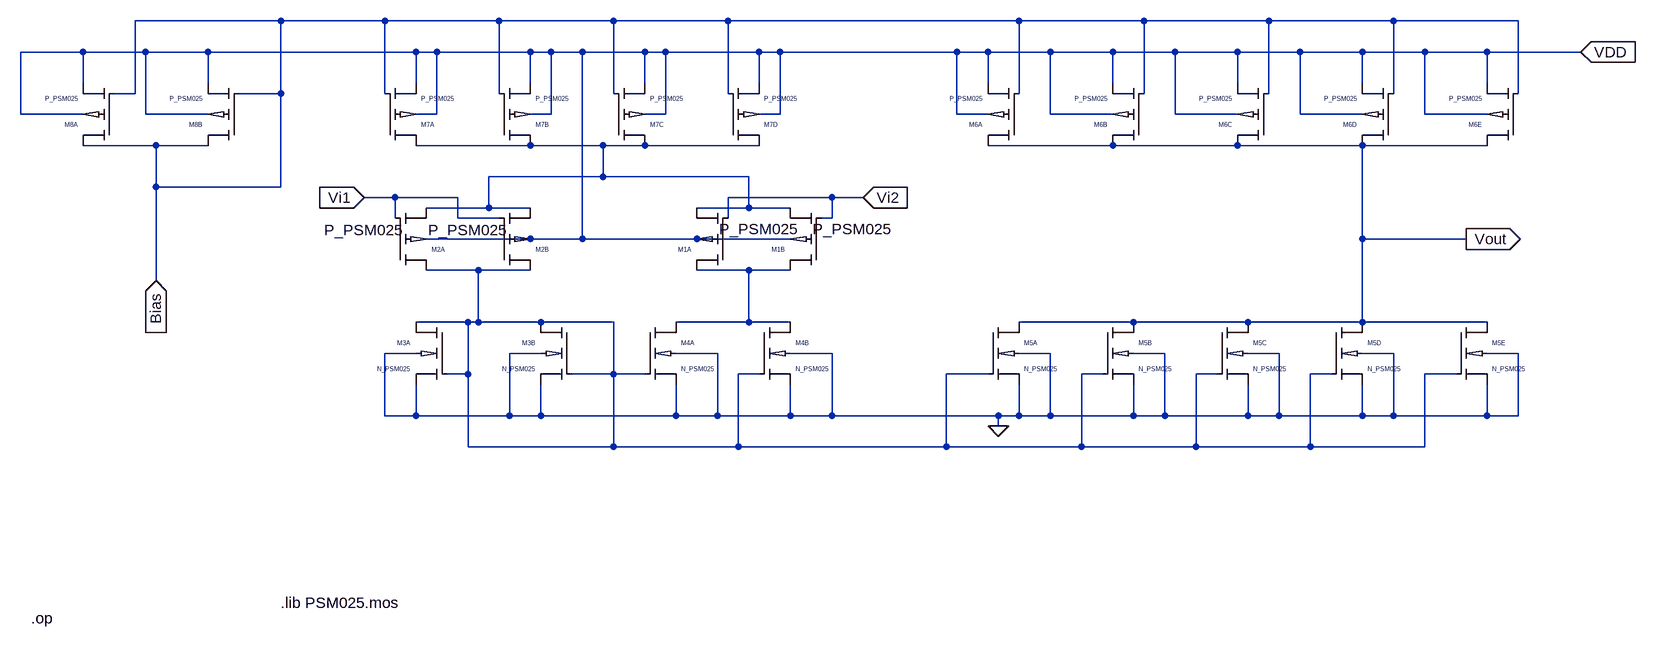
[diagram p0: schematic Draft1.asc]
Draft1.asc, the LTspice schematic file:
Version 4
SHEET 1 1956 744
WIRE -176 -224 -400 -224
WIRE -16 -224 -176 -224
WIRE 160 -224 -16 -224
WIRE 336 -224 160 -224
WIRE 512 -224 336 -224
WIRE 960 -224 512 -224
WIRE 1152 -224 960 -224
WIRE 1344 -224 1152 -224
WIRE 1536 -224 1344 -224
WIRE 1728 -224 1536 -224
WIRE -480 -176 -576 -176
WIRE -384 -176 -480 -176
WIRE -288 -176 -384 -176
WIRE 32 -176 -288 -176
WIRE 64 -176 32 -176
WIRE 208 -176 64 -176
WIRE 240 -176 208 -176
WIRE 288 -176 240 -176
WIRE 384 -176 288 -176
WIRE 416 -176 384 -176
WIRE 560 -176 416 -176
WIRE 592 -176 560 -176
WIRE 864 -176 592 -176
WIRE 912 -176 864 -176
WIRE 1008 -176 912 -176
WIRE 1104 -176 1008 -176
WIRE 1200 -176 1104 -176
WIRE 1296 -176 1200 -176
WIRE 1392 -176 1296 -176
WIRE 1488 -176 1392 -176
WIRE 1584 -176 1488 -176
WIRE 1680 -176 1584 -176
WIRE 1824 -176 1680 -176
WIRE -480 -128 -480 -176
WIRE -288 -128 -288 -176
WIRE 32 -128 32 -176
WIRE 208 -128 208 -176
WIRE 384 -128 384 -176
WIRE 560 -128 560 -176
WIRE 912 -128 912 -176
WIRE 1104 -128 1104 -176
WIRE 1296 -128 1296 -176
WIRE 1488 -128 1488 -176
WIRE 1680 -128 1680 -176
WIRE -400 -112 -400 -224
WIRE -400 -112 -432 -112
WIRE -176 -112 -176 -224
WIRE -176 -112 -240 -112
WIRE -16 -112 -16 -224
WIRE 160 -112 160 -224
WIRE 336 -112 336 -224
WIRE 512 -112 512 -224
WIRE 960 -112 960 -224
WIRE 1152 -112 1152 -224
WIRE 1344 -112 1344 -224
WIRE 1536 -112 1536 -224
WIRE 1728 -112 1728 -224
WIRE -576 -80 -576 -176
WIRE -480 -80 -576 -80
WIRE -384 -80 -384 -176
WIRE -288 -80 -384 -80
WIRE 64 -80 64 -176
WIRE 64 -80 32 -80
WIRE 240 -80 240 -176
WIRE 240 -80 208 -80
WIRE 416 -80 416 -176
WIRE 416 -80 384 -80
WIRE 592 -80 592 -176
WIRE 592 -80 560 -80
WIRE 864 -80 864 -176
WIRE 912 -80 864 -80
WIRE 1008 -80 1008 -176
WIRE 1104 -80 1008 -80
WIRE 1200 -80 1200 -176
WIRE 1296 -80 1200 -80
WIRE 1392 -80 1392 -176
WIRE 1488 -80 1392 -80
WIRE 1584 -80 1584 -176
WIRE 1680 -80 1584 -80
WIRE -368 -32 -480 -32
WIRE -288 -32 -368 -32
WIRE 208 -32 32 -32
WIRE 320 -32 208 -32
WIRE 384 -32 320 -32
WIRE 560 -32 384 -32
WIRE 1104 -32 912 -32
WIRE 1296 -32 1104 -32
WIRE 1488 -32 1296 -32
WIRE 1680 -32 1488 -32
WIRE 320 16 320 -32
WIRE 320 16 144 16
WIRE 544 16 320 16
WIRE -368 32 -368 -32
WIRE -176 32 -176 -112
WIRE -176 32 -368 32
WIRE 0 48 -48 48
WIRE 96 48 0 48
WIRE 672 48 512 48
WIRE 720 48 672 48
WIRE 144 64 144 16
WIRE 144 64 48 64
WIRE 208 64 144 64
WIRE 544 64 544 16
WIRE 544 64 464 64
WIRE 608 64 544 64
WIRE 0 80 0 48
WIRE 96 80 96 48
WIRE 160 80 96 80
WIRE 512 80 512 48
WIRE 672 80 672 48
WIRE 672 80 656 80
WIRE 208 112 48 112
WIRE 288 112 288 -176
WIRE 288 112 208 112
WIRE 464 112 288 112
WIRE 608 112 464 112
WIRE 1488 112 1488 -32
WIRE 1648 112 1488 112
WIRE 128 160 48 160
WIRE 208 160 128 160
WIRE 544 160 464 160
WIRE 608 160 544 160
WIRE -368 176 -368 32
WIRE 112 240 32 240
WIRE 128 240 128 160
WIRE 128 240 112 240
WIRE 224 240 128 240
WIRE 336 240 224 240
WIRE 544 240 544 160
WIRE 544 240 432 240
WIRE 608 240 544 240
WIRE 1136 240 960 240
WIRE 1312 240 1136 240
WIRE 1488 240 1488 112
WIRE 1488 240 1312 240
WIRE 1680 240 1488 240
WIRE 32 288 -16 288
WIRE 224 288 176 288
WIRE 496 288 432 288
WIRE 672 288 608 288
WIRE 1008 288 960 288
WIRE 1184 288 1136 288
WIRE 1360 288 1312 288
WIRE 1536 288 1488 288
WIRE 1728 288 1680 288
WIRE 112 320 112 240
WIRE 112 320 80 320
WIRE 336 320 336 240
WIRE 336 320 272 320
WIRE 384 320 336 320
WIRE 560 320 528 320
WIRE 912 320 848 320
WIRE 1088 320 1056 320
WIRE 1264 320 1232 320
WIRE 1440 320 1408 320
WIRE 1632 320 1584 320
WIRE -16 384 -16 288
WIRE 32 384 32 336
WIRE 32 384 -16 384
WIRE 176 384 176 288
WIRE 176 384 32 384
WIRE 224 384 224 336
WIRE 224 384 176 384
WIRE 432 384 432 336
WIRE 432 384 224 384
WIRE 496 384 496 288
WIRE 496 384 432 384
WIRE 608 384 608 336
WIRE 608 384 496 384
WIRE 672 384 672 288
WIRE 672 384 608 384
WIRE 928 384 672 384
WIRE 960 384 960 336
WIRE 960 384 928 384
WIRE 1008 384 1008 288
WIRE 1008 384 960 384
WIRE 1136 384 1136 336
WIRE 1136 384 1008 384
WIRE 1184 384 1184 288
WIRE 1184 384 1136 384
WIRE 1312 384 1312 336
WIRE 1312 384 1184 384
WIRE 1360 384 1360 288
WIRE 1360 384 1312 384
WIRE 1488 384 1488 336
WIRE 1488 384 1360 384
WIRE 1536 384 1536 288
WIRE 1536 384 1488 384
WIRE 1680 384 1680 336
WIRE 1680 384 1536 384
WIRE 1728 384 1728 288
WIRE 1728 384 1680 384
WIRE 928 400 928 384
WIRE 112 432 112 320
WIRE 336 432 336 320
WIRE 336 432 112 432
WIRE 528 432 528 320
WIRE 528 432 336 432
WIRE 848 432 848 320
WIRE 848 432 528 432
WIRE 1056 432 1056 320
WIRE 1056 432 848 432
WIRE 1232 432 1232 320
WIRE 1232 432 1056 432
WIRE 1408 432 1408 320
WIRE 1408 432 1232 432
WIRE 1584 432 1584 320
WIRE 1584 432 1408 432
FLAG 928 400 0
FLAG -48 48 Vi1
IOPIN -48 48 In
FLAG 720 48 Vi2
IOPIN 720 48 In
FLAG 1648 112 Vout
IOPIN 1648 112 Out
FLAG -368 176 Bias
IOPIN -368 176 In
FLAG 1824 -176 VDD
IOPIN 1824 -176 In
SYMBOL P_PSM025 -432 -32 R180
SYMATTR InstName M8A
SYMATTR Value2 l=1u w=8.5u
SYMBOL P_PSM025 656 160 R180
WINDOW 3 -108 63 Left 2
SYMATTR InstName M1B
SYMATTR Value2 l=1u w=8.5u
SYMBOL P_PSM025 0 160 M180
WINDOW 3 -109 62 Left 2
SYMATTR InstName M2A
SYMATTR Value2 l=1u w=8.5u
SYMBOL N_PSM025 80 240 M0
SYMATTR InstName M3A
SYMATTR Value2 l=1u w=2.6u
SYMBOL N_PSM025 384 240 R0
SYMATTR InstName M4A
SYMATTR Value2 l=1u w=2.6u
SYMBOL P_PSM025 -16 -32 M180
SYMATTR InstName M7A
SYMATTR Value2 l=1u w=8.5u
SYMBOL P_PSM025 160 -32 M180
SYMATTR InstName M7B
SYMATTR Value2 l=1u w=8.5u
SYMBOL P_PSM025 -240 -32 R180
SYMATTR InstName M8B
SYMATTR Value2 l=1u w=8.5u
SYMBOL P_PSM025 336 -32 M180
SYMATTR InstName M7C
SYMATTR Value2 l=1u w=8.5u
SYMBOL P_PSM025 512 -32 M180
SYMATTR InstName M7D
SYMATTR Value2 l=1u w=8.5u
SYMBOL P_PSM025 960 -32 R180
SYMATTR InstName M6A
SYMATTR Value2 l=1u w=8.5u
SYMBOL P_PSM025 1152 -32 R180
SYMATTR InstName M6B
SYMATTR Value2 l=1u w=8.5u
SYMBOL P_PSM025 1536 -32 R180
SYMATTR InstName M6D
SYMATTR Value2 l=1u w=8.5u
SYMBOL P_PSM025 1728 -32 R180
SYMATTR InstName M6E
SYMATTR Value2 l=1u w=8.5u
SYMBOL P_PSM025 1344 -32 R180
SYMATTR InstName M6C
SYMATTR Value2 l=1u w=8.5u
SYMBOL N_PSM025 1632 240 R0
SYMATTR InstName M5E
SYMATTR Value2 l=1u w=2.6u
SYMBOL N_PSM025 1440 240 R0
SYMATTR InstName M5D
SYMATTR Value2 l=1u w=2.6u
SYMBOL N_PSM025 1264 240 R0
SYMATTR InstName M5C
SYMATTR Value2 l=1u w=2.6u
SYMBOL N_PSM025 1088 240 R0
SYMATTR InstName M5B
SYMATTR Value2 l=1u w=2.6u
SYMBOL N_PSM025 912 240 R0
SYMATTR InstName M5A
SYMATTR Value2 l=1u w=2.6u
SYMBOL N_PSM025 272 240 M0
SYMATTR InstName M3B
SYMATTR Value2 l=1u w=2.6u
SYMBOL N_PSM025 560 240 R0
SYMATTR InstName M4B
SYMATTR Value2 l=1u w=2.6u
SYMBOL P_PSM025 160 160 M180
WINDOW 3 -109 62 Left 2
SYMATTR InstName M2B
SYMATTR Value2 l=1u w=8.5u
SYMBOL P_PSM025 512 160 R180
WINDOW 3 -108 63 Left 2
SYMATTR InstName M1A
SYMATTR Value2 l=1u w=8.5u
TEXT -560 696 Left 2 !.op
TEXT -176 672 Left 2 !.lib PSM025.mos

The netlist it stands for:
* Draft1.asc
M8A Bias Bias VDD VDD P_PSM025 l=1u w=8.5u
M1B N003 Vi2 N001 VDD P_PSM025 l=1u w=8.5u
M2A N002 Vi1 N001 VDD P_PSM025 l=1u w=8.5u
M3A N002 N002 0 0 N_PSM025 l=1u w=2.6u
M4A N003 N002 0 0 N_PSM025 l=1u w=2.6u
M7A N001 Bias VDD VDD P_PSM025 l=1u w=8.5u
M7B N001 Bias VDD VDD P_PSM025 l=1u w=8.5u
M8B Bias Bias VDD VDD P_PSM025 l=1u w=8.5u
M7C N001 Bias VDD VDD P_PSM025 l=1u w=8.5u
M7D N001 Bias VDD VDD P_PSM025 l=1u w=8.5u
M6A Vout Bias VDD VDD P_PSM025 l=1u w=8.5u
M6B Vout Bias VDD VDD P_PSM025 l=1u w=8.5u
M6D Vout Bias VDD VDD P_PSM025 l=1u w=8.5u
M6E Vout Bias VDD VDD P_PSM025 l=1u w=8.5u
M6C Vout Bias VDD VDD P_PSM025 l=1u w=8.5u
M5E Vout N002 0 0 N_PSM025 l=1u w=2.6u
M5D Vout N002 0 0 N_PSM025 l=1u w=2.6u
M5C Vout N002 0 0 N_PSM025 l=1u w=2.6u
M5B Vout N002 0 0 N_PSM025 l=1u w=2.6u
M5A Vout N002 0 0 N_PSM025 l=1u w=2.6u
M3B N002 N002 0 0 N_PSM025 l=1u w=2.6u
M4B N003 N002 0 0 N_PSM025 l=1u w=2.6u
M2B N002 Vi1 N001 VDD P_PSM025 l=1u w=8.5u
M1A N003 Vi2 N001 VDD P_PSM025 l=1u w=8.5u
.model NMOS NMOS
.model PMOS PMOS
.lib standard.mos
.op
.lib PSM025.mos
.lib PSM025.mos
.backanno
.end